# EAGLE design footswitch (EAGLE 7.4.0)
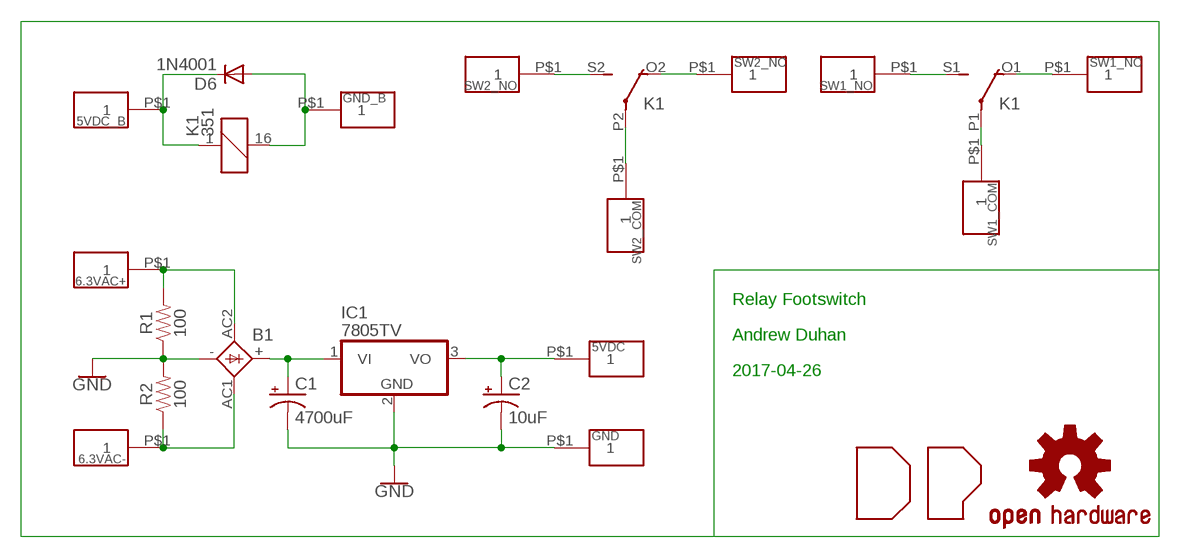
[diagram p0: schematic, sheet 1]

## Parts
5VDC  TURRET_LUG_1540  [TURRET_LUG_1540]
5VDC_B  TURRET_LUG_1540  [TURRET_LUG_1540]
6.3VAC+  TURRET_LUG_1540  [TURRET_LUG_1540]
6.3VAC-  TURRET_LUG_1540  [TURRET_LUG_1540]
B1  GBU4  [GBU4S]
C1  4700uF  CPOL-USE7.5-18  [E7,5-18]
C2  10uF  10UF-POLAR-RADIAL-2.5MM-25V-20%  [CPOL-RADIAL-2.5MM-5MM]
D6  1N4001  1N4004  [DO41-10]
GND  TURRET_LUG_1540  [TURRET_LUG_1540]
GND_B  TURRET_LUG_1540  [TURRET_LUG_1540]
IC1  7805TV  [TO220V]
K1  351  [351]
LOGO1  OSHW-LOGOMINI  [OSHW-LOGO-MINI]
LOGO2  OSHW-LOGOMINI  [OSHW-LOGO-MINI]
R1  100  RESISTORAXIAL-0.3  [AXIAL-0.3]
R2  100  RESISTORAXIAL-0.3  [AXIAL-0.3]
SW1_COM  TURRET_LUG_1540  [TURRET_LUG_1540]
SW1_NC  TURRET_LUG_1540  [TURRET_LUG_1540]
SW1_NO  TURRET_LUG_1540  [TURRET_LUG_1540]
SW2_COM  TURRET_LUG_1540  [TURRET_LUG_1540]
SW2_NC  TURRET_LUG_1540  [TURRET_LUG_1540]
SW2_NO  TURRET_LUG_1540  [TURRET_LUG_1540]
U$1  DP_LOGO  [DP_LOGO]
U$2  DP_LOGO  [DP_LOGO]

## Nets
5VDC: 5VDC.P$1 C2.1(+) IC1.3(VO)
5VDC_B: 5VDC_B.P$1 D6.C K1.1
GND: B1.- C1.- C2.2(-) GND.P$1 IC1.2(GND) R1.P$1 R2.P$2
GND_B: D6.A GND_B.P$1 K1.16
N$1: B1.+ C1.+ IC1.1(VI)
N$2: 6.3VAC+.P$1 B1.AC2(AC1) R1.P$2
N$3: 6.3VAC-.P$1 B1.AC1(AC2) R2.P$1
N$4: K1.P2(3:P) SW2_COM.P$1
N$5: K1.O2(3:O) SW2_NC.P$1
N$6: K1.S2(3:S) SW2_NO.P$1
N$7: K1.O1(2:O) SW1_NC.P$1
N$8: K1.S1(2:S) SW1_NO.P$1
N$9: K1.P1(2:P) SW1_COM.P$1

## Notes on the sheet
- Relay Footswitch
- Andrew Duhan
- 2017-04-26

## Library data of the parts
5VDC 5VDC_B 6.3VAC+ 6.3VAC- GND GND_B SW1_COM SW1_NC SW1_NO SW2_COM SW2_NC SW2_NO = myparts:TURRET_LUG_1540
B1 = rectifier:GBU4: GENERAL INSTRUMENT RECTIFIER
C1 = adafruit:CPOL-US: POLARIZED CAPACITOR, American symbol
C2 = SparkFun-Capacitors:10UF-POLAR: 10.0µF polarized capacitors A capacitor is a passive two-terminal electrical component used to store electrical energy temporarily in an electric field.; PROD_ID: CAP-08440
D6 = adafruit:1N4004: DIODE General purpose 1N400x type rectifier (With bigger pads) http://www.ladyada.net/library/pcb/eaglelibrary.html
IC1 = linear:78*: Positive VOLTAGE REGULATOR Source: http://cache.national.com/ds/LM/LM78L05.pdf http://www.fairchildsemi.com/ds/LM/LM7805.pdf
K1 = relay:351: RELAY 2 x switch, Omron; OC_FARNELL: unknown; OC_NEWARK: unknown
LOGO1 LOGO2 = SparkFun-Aesthetics:OSHW-LOGO: Open-Source Hardware (OSHW) Logo This logo indicates the piece of hardware it is found on incorporates a OSHW license and/or adheres to the definition of open source hardware found here: http://freedomdefined.org/OSHW
R1 R2 = SparkFun-Resistors:RESISTOR: Generic Resistor Package
U$1 U$2 = myparts:DP_LOGO: Duhan Power! logo

## Board
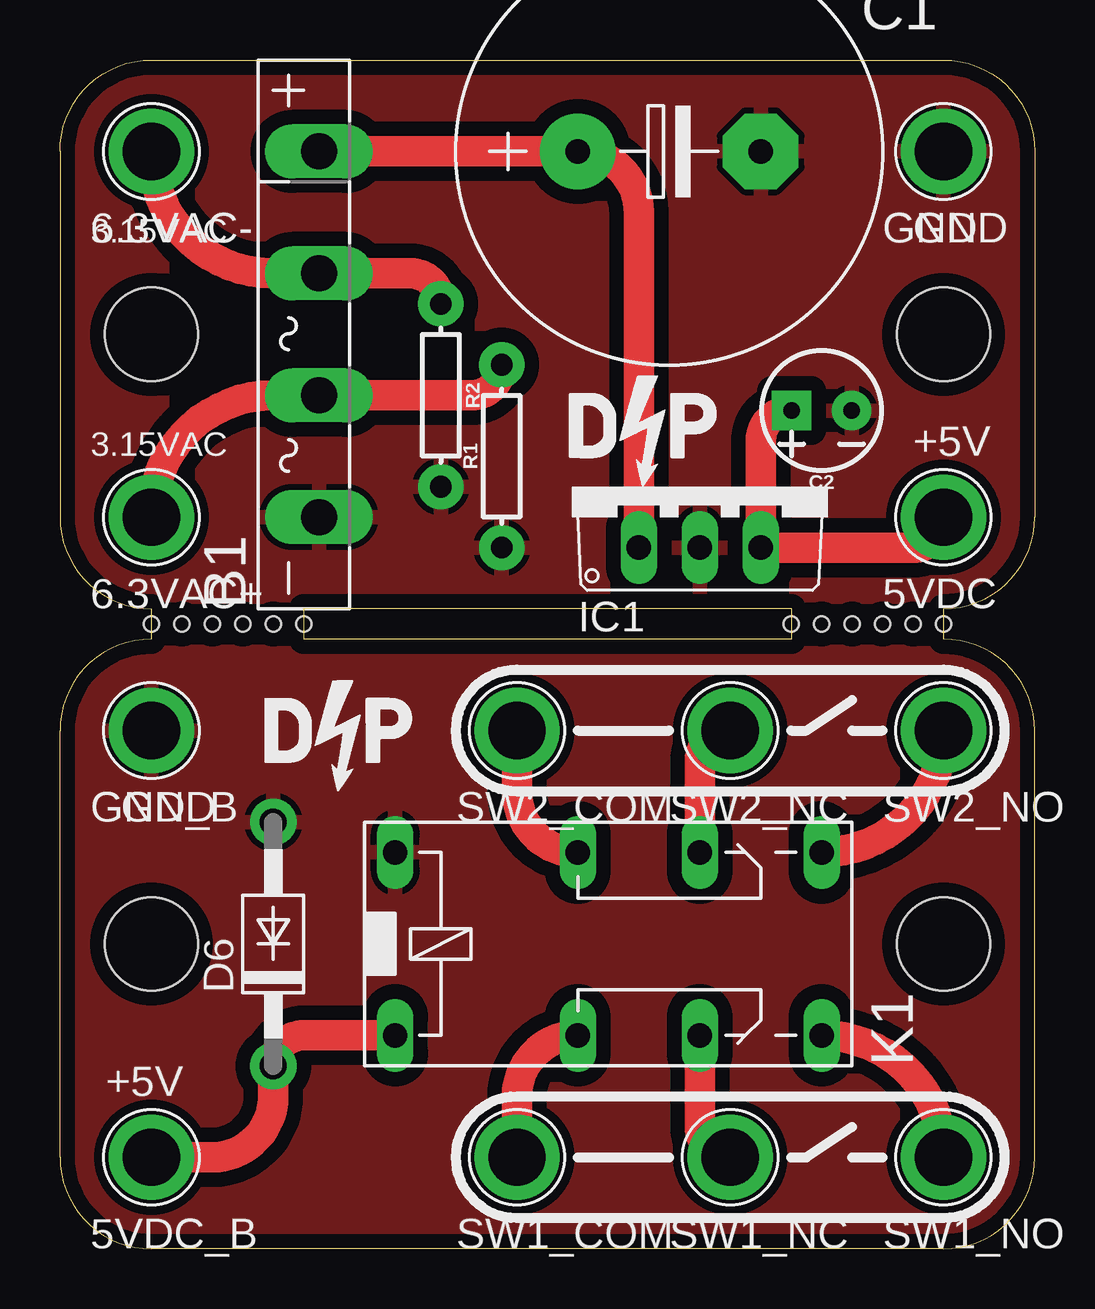
[diagram p1: board, top side]
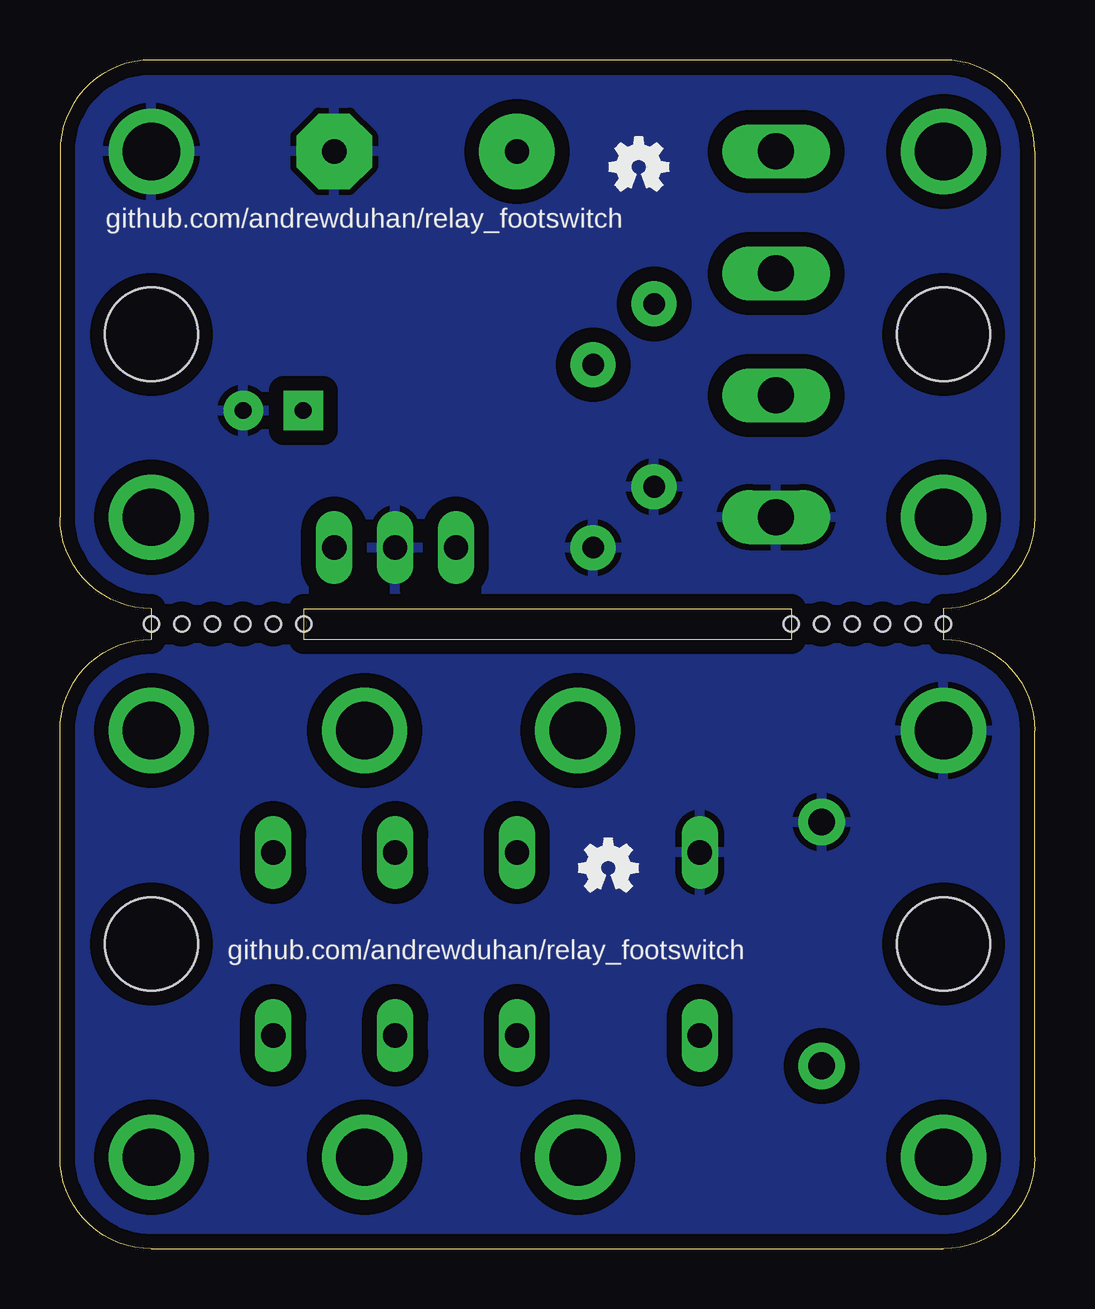
[diagram p2: board, bottom side, seen from below]

Size 40.64 x 49.53 mm. Coordinates in mm from the lower left corner, seen from the top.
Outline: 0,10.79 0,14.61
Outline: 0,45.72 0,30.48 arc90 3.81,26.67 3.81,25.4 arc90 0,21.59 0,3.81 arc90 3.81,0 36.83,0 arc90 40.64,3.81 40.64,21.59 arc90 36.83,25.4 36.83,26.67 arc90 40.64,30.48 40.64,45.72 arc90 36.83,49.53 3.81,49.53 arc90 0,45.72
Outline: 30.48,25.4 10.16,25.4 10.16,26.67 30.48,26.67 30.48,25.4
Copper layers (1*16): Top 0.035mm / dielectric 1.5mm / Bottom 0.035mm
Design rules "dirt_cheap_dirty_boards.v1": minimum track width 5mil, minimum drill 12mil, track to track 5mil, track to pad 5mil, pad to pad 5mil, via to via 5mil, smd to smd 0mil, copper to edge 10mil, drill to drill 10mil, minimum pad ring 10mil, minimum via ring 6mil, stop-mask expansion 2mil, vias tented up to drill 25mil, thermal gap 10mil
Holes 3.89 mm at 3.81,38.1 36.83,38.1 3.81,12.7 36.83,12.7
Holes 0.64 mm at 36.83,26.04 3.81,26.04 5.08,26.04 6.35,26.04 7.62,26.04 8.89,26.04 35.56,26.04 34.29,26.04 33.02,26.04 31.75,26.04 30.48,26.04 10.16,26.04

### Footprints (pad centres in the part's own frame; a part is rotated, then mirrored left to right if it is on the bottom)
TURRET_LUG_1540 = drill 2.388 pad 3.556: P$1 0,0
GBU4S = drill 1.499 long: + 7.62,0; - -7.62,0; AC1 2.54,0; AC2 -2.54,0
E7,5-18 = drill 1.016 pad 3.15: + -3.81,0 | drill 1.016 pad 3.15 octagon: - 3.81,0
CPOL-RADIAL-2.5MM-5MM = drill 0.7 pad 1.651 square: 1 1.25,0 | drill 0.7 pad 1.651: 2 -1.25,0
DO41-10 = drill 1.118 pad 1.93: A 5.08,0; C -5.08,0
TO220V = drill 1.016 long: 1 -2.54,-2.54; 2 0,-2.54; 3 2.54,-2.54
351 = drill 1.016 long: 1 -3.81,-3.81; 16 -3.81,3.81; O1 8.89,-3.81; O2 8.89,3.81; P1 3.81,-3.81; P2 3.81,3.81; S1 13.97,-3.81; S2 13.97,3.81
AXIAL-0.3 = drill 0.9 pad 1.88: P$1 -3.81,0; P$2 3.81,0

### Placement (x,y rotation side)
5VDC  36.83,30.48 0 top
5VDC_B  3.81,3.81 0 top
6.3VAC+  3.81,30.48 0 top
6.3VAC-  3.81,45.72 0 top
B1  10.79,38.1 90 top
C1  25.4,45.72 0 top
C2  31.75,34.92 180 top
D6  8.89,12.7 90 top
GND  36.83,45.72 0 top
GND_B  3.81,21.59 0 top
IC1  26.67,31.75 0 top
K1  17.78,12.7 0 top
LOGO1  17.78,15.88 0 bottom
LOGO2  16.51,45.09 0 bottom
R1  18.41,33.02 90 top
R2  15.88,35.56 270 top
SW1_COM  19.05,3.81 0 top
SW1_NC  27.94,3.81 0 top
SW1_NO  36.83,3.81 0 top
SW2_COM  19.05,21.59 0 top
SW2_NC  27.94,21.59 0 top
SW2_NO  36.83,21.59 0 top
U$1  11.43,21.59 0 top
U$2  24.13,34.29 0 top

### Tracks (layer width: path | path; a pad name or v marks a point on that pad's centre or on a via)
5VDC
  Top 1.27: 5VDC.P$1 arc-90 35.56,29.21 IC1.3 29.21,33.66 arc-91 C2.1
5VDC_B
  Top 1.27: K1.1 10.16,8.89 arc90 D6.C 8.89,6.35 arc-90 6.35,3.81 5VDC_B.P$1
GND
  pour Top (isolate 0.61, rank 4): 0,49.53 40.64,49.53 40.64,26.67 0,26.67
  pour Bottom (isolate 0.61, rank 3): 0,49.53 40.64,49.53 40.64,26.67 0,26.67
GND_B
  pour Top (isolate 0.61): 0,25.4 0,0 40.64,0 40.64,25.4
  pour Bottom (isolate 0.61, rank 3): 0,25.4 0,0 40.64,0 40.64,25.4
N$1
  Top 1.27: B1.+ C1.+ arc-90 24.13,43.18 IC1.1
N$2
  Top 1.27: 6.3VAC+.P$1 arc-90 8.89,35.56 B1.AC2 17.14,35.56 arc90 R1.P$2
N$3
  Top 1.27: 6.3VAC-.P$1 arc90 8.89,40.64 B1.AC1 14.61,40.64 arc-90 R2.P$1
N$4
  Top 1.27: SW2_COM.P$1 19.05,19.05 arc90 K1.P2
N$5
  Top 1.27: K1.O2 26.67,20.32 arc-90 SW2_NC.P$1
N$6
  Top 1.27: K1.S2 arc90 SW2_NO.P$1
N$7
  Top 1.27: K1.O1 26.67,5.08 arc90 SW1_NC.P$1
N$8
  Top 1.27: K1.S1 arc-90 SW1_NO.P$1
N$9
  Top 1.27: SW1_COM.P$1 19.05,6.35 arc-90 K1.P1

### Text on the board
tPlace: 3.15VAC | GND | 3.15VAC | +5V | GND | +5V
bPlace: github.com/andrewduhan/relay_footswitch | github.com/andrewduhan/relay_footswitch